# EAGLE design detector2 (EAGLE 5.11)
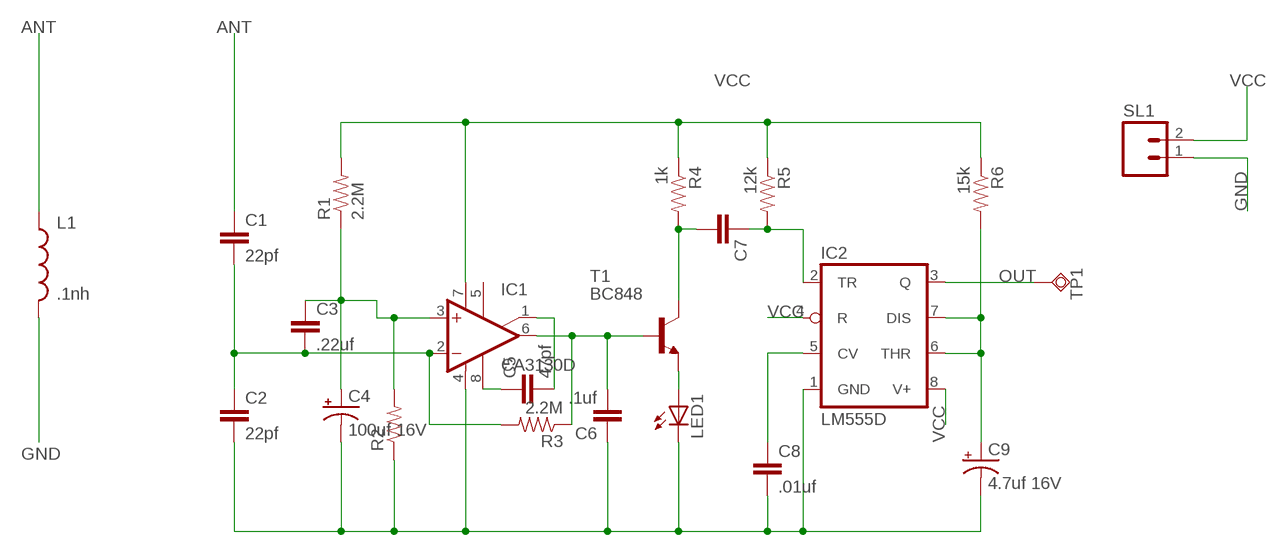
[diagram p0: schematic, sheet 1]

## Parts
C1  22pf  CAP0805  [0805]
C2  22pf  CAP0805  [0805]
C3  .22uf  CAP8MM  [CAP-8MM-SPACE]
C4  100uf 16V  CAP_POL7343  [EIA7343]
C5  47pf  CAP0805  [0805]
C6  .1uf  CAP0805  [0805]
C7  CAP0805  [0805]
C8  .01uf  CAP0805  [0805]
C9  4.7uf 16V  CAP_POL1206  [EIA3216]
IC1  CA3130D  [SO08]
IC2  LM555D  [SO08]
L1  .1nh  INDUCTOR0805  [0805]
LED1  LEDCHIPLED_1206  [CHIPLED_1206]
R1  2.2M  RESISTOR0805-RES  [0805]
R2  RESISTOR0805-RES  [0805]
R3  2.2M  RESISTOR0805-RES  [0805]
R4  1k  RESISTOR0805-RES  [0805]
R5  12k  RESISTOR0805-RES  [0805]
R6  15k  RESISTOR0805-RES  [0805]
SL1  M02  [02P]
T1  BC848  [SOT23]
TP1  TPSQTP20SQ  [TP20SQ]

## Nets
ANT: C1.1 L1.1
GND: C2.2 C4.C(-) C6.1 C8.2 C9.C(-) IC1.4(V-) IC2.1(GND) L1.2 LED1.C R2.1 SL1.1
N$1: C7.2 R4.2 T1.3(C)
N$2: C1.2 C2.1 C3.2 IC1.2(-IN) R3.2
N$4: C3.1 C4.A(+) IC1.3(+IN) R1.1 R2.2
N$5: C8.1 IC2.5(CV)
N$6: C6.2 IC1.6(OUT) R3.1 T1.1(B)
N$7: C5.1 IC1.8(CMP)
N$8: C5.2 IC1.1(ON/CMP)
N$9: C7.1 IC2.2(TR) R5.2
N$10: C9.A(+) IC2.6(THR) IC2.7(DIS) R6.2
N$11: LED1.A T1.2(E)
OUT: IC2.3(Q) TP1.TP
VCC: IC1.7(V+) IC2.4(R) IC2.8(V+) R1.2 R4.1 R5.1 R6.1 SL1.2
Unconnected: IC1.5(ON)

## Library data of the parts
C1 C2 C5-C8 = SparkFun:CAP: Capacitor Standard 0603 ceramic capacitor, and 0.1" leaded capacitor.
C3 = detector2:CAP: Capacitor Standard 0603 ceramic capacitor, and 0.1" leaded capacitor.
C4 C9 = SparkFun:CAP_POL: Capacitor Polarized These are standard SMD and PTH capacitors. Normally 10uF, 47uF, and 100uF in electrolytic and tantalum varieties. Always verify the external diameter of the through hole cap, it varies with capacity, voltage, and manufacturer. The EIA devices should be standard.
IC1 = linear:CA3130: OP AMP
IC2 = linear:*555: TIMER
L1 = SparkFun:INDUCTOR: Inductors Basic Inductor/Choke - 0603 and 1206. Footprints are not proven and vary greatly between part numbers.
LED1 = led:LED: LED OSRAM: - CHIPLED LG R971, LG N971, LY N971, LG Q971, LY Q971, LO R971, LY R971 LH N974, LH R974 LS Q976, LO Q976, LY Q976 LO Q996 - Hyper CHIPLED LW Q18S LB Q993, LB Q99A, LB R99A - SideLED LS A670, LO A670, LY A670, LG A670, LP A670 LB A673, LV A673, LT A673, LW A673 LH A674 LY A675 LS A676, LA A676, LO A676, LY A676, LW A676 LS A679, LY A679, LG A679 - Hyper Micro SIDELED® LS Y876, LA Y876, LO Y876, LY Y876 LT Y87S - SmartLED LW L88C, LW L88S LB L89C, LB L89S, LG L890 LS L89K, LO L89K, LY L89K LS L896, LA L896, LO L896, LY L896 - TOPLED LS T670, LO T670, LY T670, LG T670, LP T670 LSG T670, LSP T670, LSY T670, LOP T670, LYG T670 LG T671, LOG T671, LSG T671 LB T673, LV T673, LT T673, LW T673 LH T674 LS T676, LA T676, LO T676, LY T676, LB T676, LH T676, LSB T676, LW T676 LB T67C, LV T67C, LT T67C, LS T67K, LO T67K, LY T67K, LW E67C LS E67B, LA E67B, LO E67B, LY E67B, LB E67C, LV E67C, LT E67C LW T67C LS T679, LY T679, LG T679 LS T770, LO T770, LY T770, LG T770, LP T770 LB T773, LV T773, LT T773, LW T773 LH T774 LS E675, LA E675, LY E675, LS T675 LS T776, LA T776, LO T776, LY T776, LB T776 LHGB T686 LT T68C, LB T68C - Hyper Mini TOPLED® LB M676 - Mini TOPLED Santana® LG M470 LS M47K, LO M47K, LY M47K Source: http://www.osram.convergy.de LUXEON: - LUMILED® LXK2-PW12-R00, LXK2-PW12-S00, LXK2-PW14-U00, LXK2-PW14-V00 LXK2-PM12-R00, LXK2-PM12-S00, LXK2-PM14-U00 LXK2-PE12-Q00, LXK2-PE12-R00, LXK2-PE12-S00, LXK2-PE14-T00, LXK2-PE14-U00 LXK2-PB12-K00, LXK2-PB12-L00, LXK2-PB12-M00, LXK2-PB14-N00, LXK2-PB14-P00, LXK2-PB14-Q00 LXK2-PR12-L00, LXK2-PR12-M00, LXK2-PR14-Q00, LXK2-PR14-R00 LXK2-PD12-Q00, LXK2-PD12-R00, LXK2-PD12-S00 LXK2-PH12-R00, LXK2-PH12-S00 LXK2-PL12-P00, LXK2-PL12-Q00, LXK2-PL12-R00 Source: www.luxeon.com KINGBRIGHT: KA-3528ASYC Source: www.kingbright.com
R1-R6 = SparkFun:RESISTOR: Resistor Basic schematic elements and footprints for 0603, 1206, and PTH resistors.
SL1 = con-amp-quick:M02: AMP QUICK CONNECTOR; OC_FARNELL: unknown; OC_NEWARK: unknown
T1 = transistor:BC848: NPN TRANSISTOR
TP1 = FED_detector_motor:TPSQ: Test pad

## Board
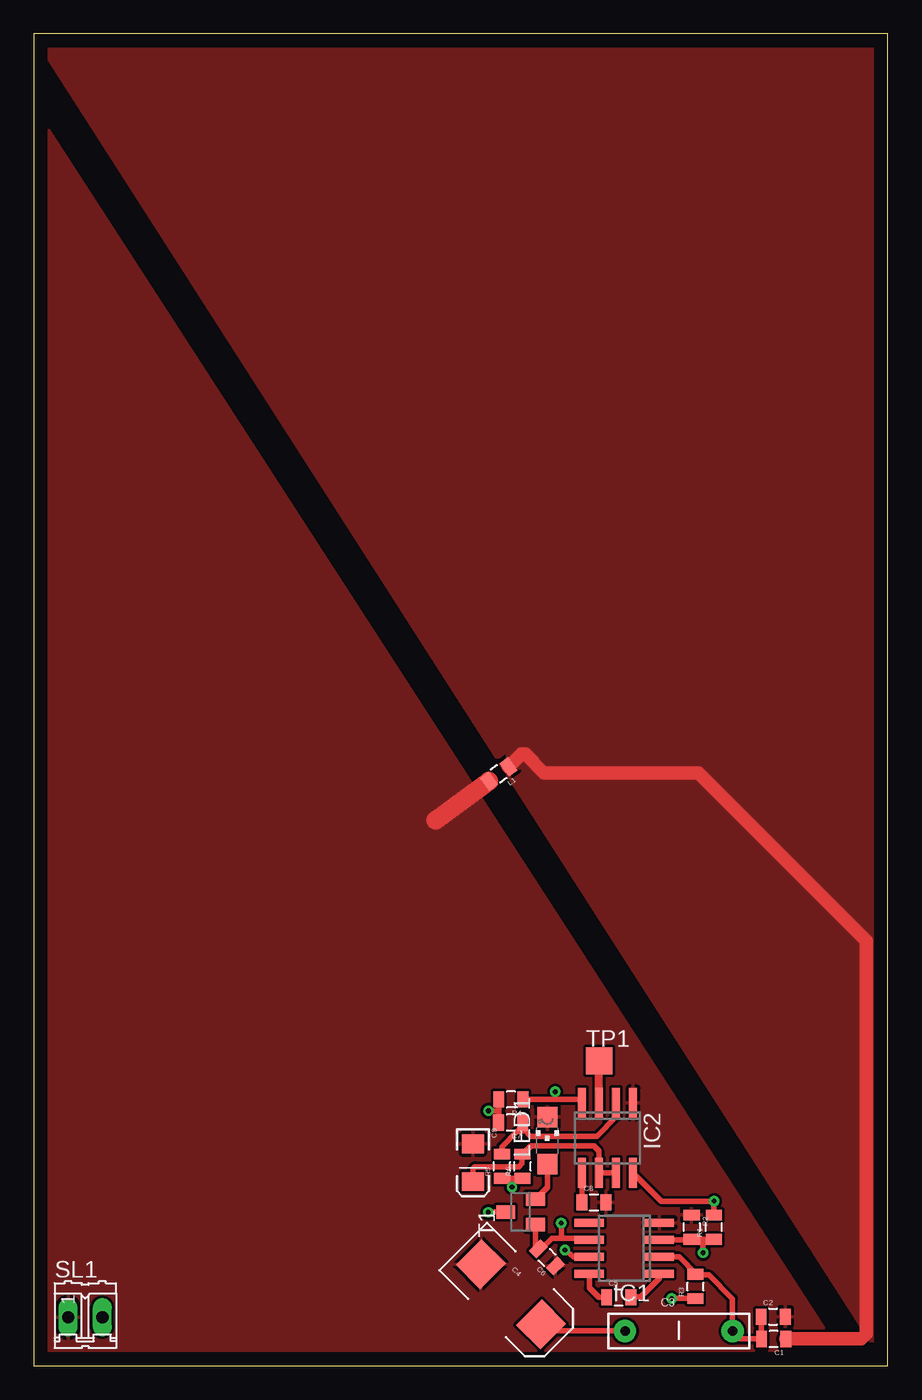
[diagram p1: board, top side]
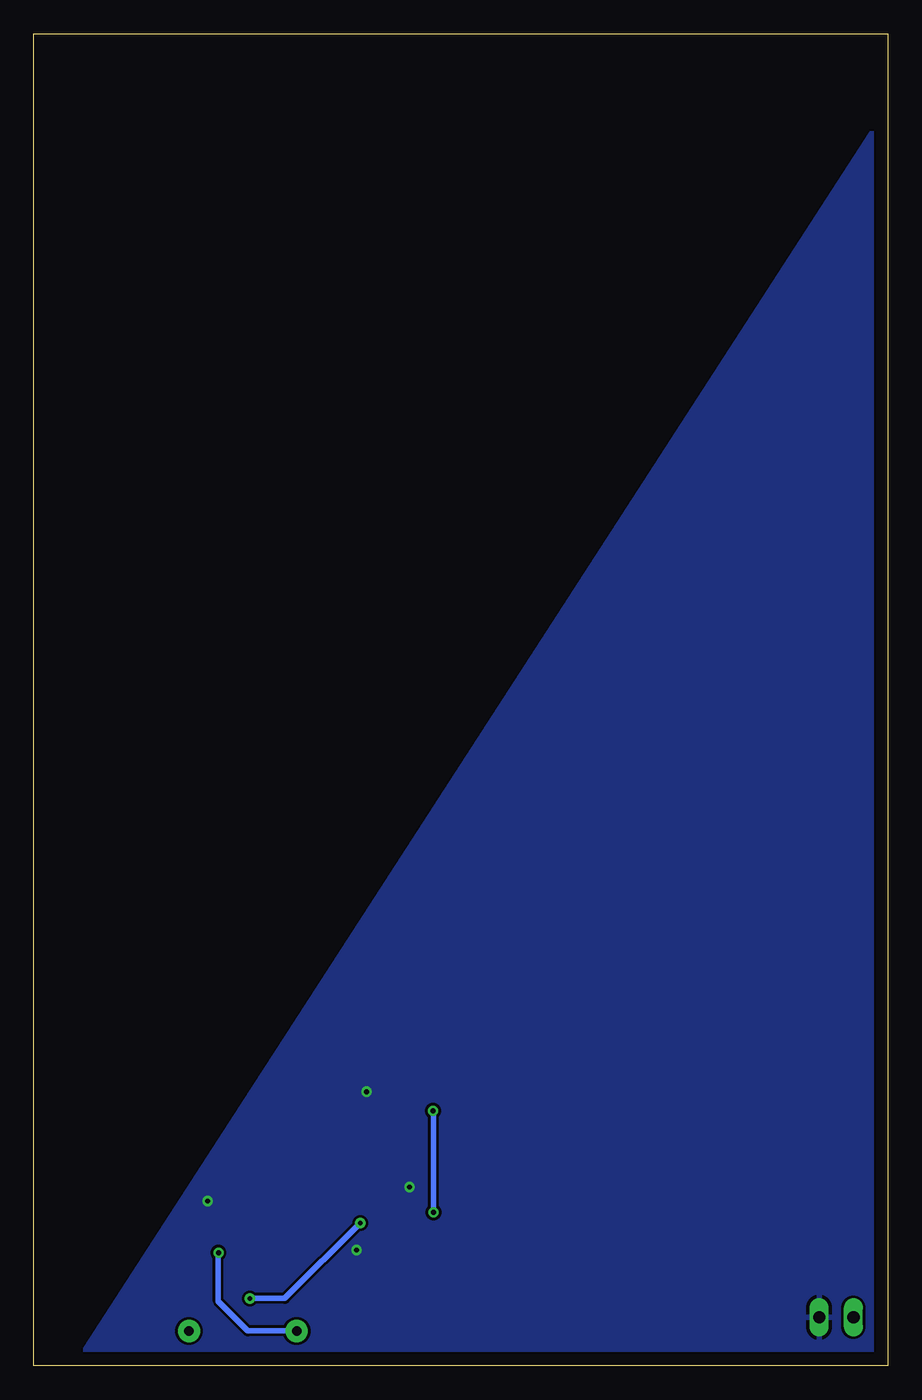
[diagram p2: board, bottom side, seen from below]

Size 63.5 x 99 mm. Coordinates in mm from the lower left corner, seen from the top.
Outline: 0,0 63.5,0 63.5,99 0,99 0,0
Copper layers (1*16): Top 0.035mm / dielectric 1.5mm / Bottom 0.035mm
Design rules "default": minimum track width 10mil, minimum drill 24mil, track to track 8mil, track to pad 8mil, pad to pad 8mil, via to via 8mil, smd to smd 8mil, copper to edge 40mil, drill to drill 8mil, minimum pad ring 10mil, minimum via ring 8mil, stop-mask expansion 4mil, vias tented up to drill 0mil, thermal gap 10mil

### Footprints (pad centres in the part's own frame; a part is rotated, then mirrored left to right if it is on the bottom)
0805 = smd 0.8 x 1.2: 1 -0.9,0; 2 0.9,0
CAP-8MM-SPACE = drill 0.7 pad 1.651 round: 1 -4,0; 2 4,0
EIA7343 = smd 2.55 x 2.7: A 3.17,0; C -3.17,0
EIA3216 = smd 1.4 x 1.6: A 1.4,0; C -1.4,0
SO08 = smd 0.6 x 2.2: 1 -1.905,-2.6; 2 -0.635,-2.6; 3 0.635,-2.6; 4 1.905,-2.6; 5 1.905,2.6; 6 0.635,2.6; 7 -0.635,2.6; 8 -1.905,2.6
CHIPLED_1206 = smd 1.5 x 1.5: A 0,-1.75; C 0,1.75
02P = drill 0.914 long: 1 -1.27,0; 2 1.27,0
SOT23 = smd 1 x 1.4: 1 -0.95,-1.1; 2 0.95,-1.1; 3 0,1.1
TP20SQ = smd 2 x 2: TP 0,0

### Placement (x,y rotation side)
C1  55,2 180 top
C2  54.97,3.65 0 top
C3  47.95,2.59 0 top
C4  35.47,5.32 315 top
C5  43.5,5.09 0 top
C6  38.16,8.06 135 top
C7  .1uf  [0805]  35.46,18.08 180 top
C8  41.64,12.15 0 top
C9  32.65,15.09 270 top
IC1  43.9,8.74 90 top
IC2  42.65,16.94 180 top
L1  34.56,43.98 216 top
LED1  38.18,16.74 0 top
R1  50.55,10.31 90 top
R2  100k  [0805]  48.91,10.31 270 top
R3  49.19,5.9 90 top
R4  35.48,19.8 180 top
R5  34.81,14.83 90 top
R6  36.33,14.83 90 top
SL1  3.84,3.61 0 top
T1  36.19,11.44 90 top
TP1  42.04,22.66 0 top

### Tracks (layer width: path | path; a pad name or v marks a point on that pad's centre or on a via)
ANT
  Top 1.016: C1.1 61.51,2 61.9,2.39 61.9,31.57 49.4,44.07 37.95,44.07 36.55,45.47 36.25,45.47 L1.1
  pour Top: 63.5,0 0,99 63.5,99
GND
  Top 1.422: 29.9,40.56 L1.2
  pour Top: 0,0 60.5,0 0,93.5
N$1  (via drill 0.36)
  Top 0.406: 34.58,18.95 34.58,18.09 arc-90 C7.2 | 34.58,18.95 R4.2 | T1.3 33.82,11.44 v33.78,11.4 | v33.81,18.95 34.58,18.95
  Bottom 0.406: v33.78,11.4 33.78,18.92 v33.81,18.95
N$2
  Top 0.406: C2.1 54.08,2.02 C1.2 52.54,2 C3.2 51.95,5 50.19,6.76 49.23,6.76 R3.2 49.19,6.89 47.98,8.1 IC1.2
N$4  (via drill 0.36)
  Top 0.406: IC1.3 48.86,9.37 R2.2 49.84,9.41 | 49.84,9.41 R1.1 | C3.1 38.2,2.59 arc-90 C4.A | v49.76,8.41 49.76,9.34 49.84,9.41
  Bottom 0.406: C3.1 47.58,2.6 49.78,4.8 49.78,8.38 v49.76,8.41
N$5
  Top 0.406: C8.1 IC2.5
N$6  (via drill 0.36)
  Top 0.406: IC1.6 41.2,9.47 40.26,9.47 39.17,9.47 | 39.17,9.47 38.51,9.47 37.72,8.69 C6.2 37.29,8.92 T1.1 | R3.1 v47.42,5 | v39.22,10.62 39.22,9.53 39.17,9.47
  Bottom 0.406: v47.42,5 44.83,5 v39.22,10.62
N$7
  Top 0.406: C5.1 42.03,5.09 arc90 42.01,5.08 41.3,5.79 IC1.8
N$8
  Top 0.406: C5.2 44.43,5.13 45.14,5.13 46.5,6.5 IC1.1
N$9
  Top 0.406: C7.1 36.55,17.89 36.55,17.45 | 36.55,17.45 36.93,17.07 41.86,17.07 43.28,18.49 IC2.2 | R5.2 34.8,15.74 34.8,16.28 35.97,17.45 36.55,17.45
N$10
  Top 0.406: IC2.7 IC2.6 42.01,15.98 41.63,16.36 36.96,16.36 R6.2 36.33,15.45 36.3,15.42 36.3,15.04 36.07,14.81 32.79,14.81 32.64,14.66 32.64,13.71 C9.A
N$11
  Top 0.406: T1.2 38.18,13.28 LED1.A
OUT
  Top 0.61: IC2.3 42.01,22.63 TP1.TP
VCC  (via drill 0.36)
  Top 0.406: R1.2 50.57,11.23 v50.57,12.24 46.65,12.24 IC2.8 | v39.5,8.61 40.11,8.1 IC1.7 | R5.1 | R5.1 35.59,13.93 | 35.59,13.93 R6.1 | v35.56,13.28 35.59,13.31 35.59,13.93 | IC2.4 40.49,19.8 38.79,19.8 | R4.1 38.79,19.8 | v38.76,20.37 38.79,20.34 38.79,19.8
  pour Bottom: 0.03,0.03 60.45,0 0,93.47